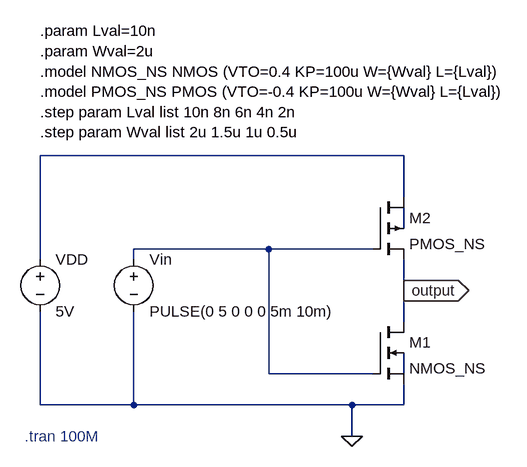
[diagram p0: schematic NS_draft.asc]
NS_draft.asc, the LTspice schematic file:
Version 4
SHEET 1 880 872
WIRE 288 352 -272 352
WIRE 288 416 288 352
WIRE 288 464 288 432
WIRE 80 496 -128 496
WIRE 240 496 80 496
WIRE -272 512 -272 352
WIRE -128 512 -128 496
WIRE 288 560 288 512
WIRE 288 608 288 560
WIRE 80 688 80 496
WIRE 240 688 80 688
WIRE 288 688 288 656
WIRE -272 736 -272 592
WIRE -128 736 -128 592
WIRE -128 736 -272 736
WIRE 208 736 -128 736
WIRE 288 736 288 704
WIRE 288 736 208 736
WIRE 208 784 208 736
FLAG 208 784 0
FLAG 288 560 output
IOPIN 288 560 Out
SYMBOL voltage -272 496 R0
SYMATTR InstName VDD
SYMATTR Value 5V
SYMBOL voltage -128 496 R0
WINDOW 123 0 0 Left 0
WINDOW 39 0 0 Left 0
SYMATTR InstName Vin
SYMATTR Value PULSE(0 5 0 0 0 5m 10m)
SYMBOL nmos4 240 608 R0
SYMATTR InstName M1
SYMATTR Value NMOS_NS
SYMBOL pmos4 240 416 R0
SYMATTR InstName M2
SYMATTR Value PMOS_NS
TEXT -272 160 Left 2 !.param Lval=10n\n.param Wval=2u\n.model NMOS_NS NMOS (VTO=0.4 KP=100u W={Wval} L={Lval})\n.model PMOS_NS PMOS (VTO=-0.4 KP=100u W={Wval} L={Lval})\n.step param Lval list 10n 8n 6n 4n 2n\n.step param Wval list 2u 1.5u 1u 0.5u
TEXT -296 784 Left 2 ;.tran 100M

The netlist it stands for:
* NS_draft.asc
VDD N001 0 5V
Vin N003 0 PULSE(0 5 0 0 0 5m 10m)
M1 output N003 0 N004 NMOS_NS
M2 N001 N003 output N002 PMOS_NS
.model NMOS NMOS
.model PMOS PMOS
.lib standard.mos
.param Lval=10n
.param Wval=2u
.model NMOS_NS NMOS (VTO=0.4 KP=100u W={Wval} L={Lval})
.model PMOS_NS PMOS (VTO=-0.4 KP=100u W={Wval} L={Lval})
.step param Lval list 10n 8n 6n 4n 2n
.step param Wval list 2u 1.5u 1u 0.5u
* .tran 100M
.backanno
.end